# Altium project Electronic Load.PrjPcb (part 2 of 3)

## Sheet Power Page 1.SchDoc
size 406 x 304 mm; SheetNumber: 12; SheetTotal: 14
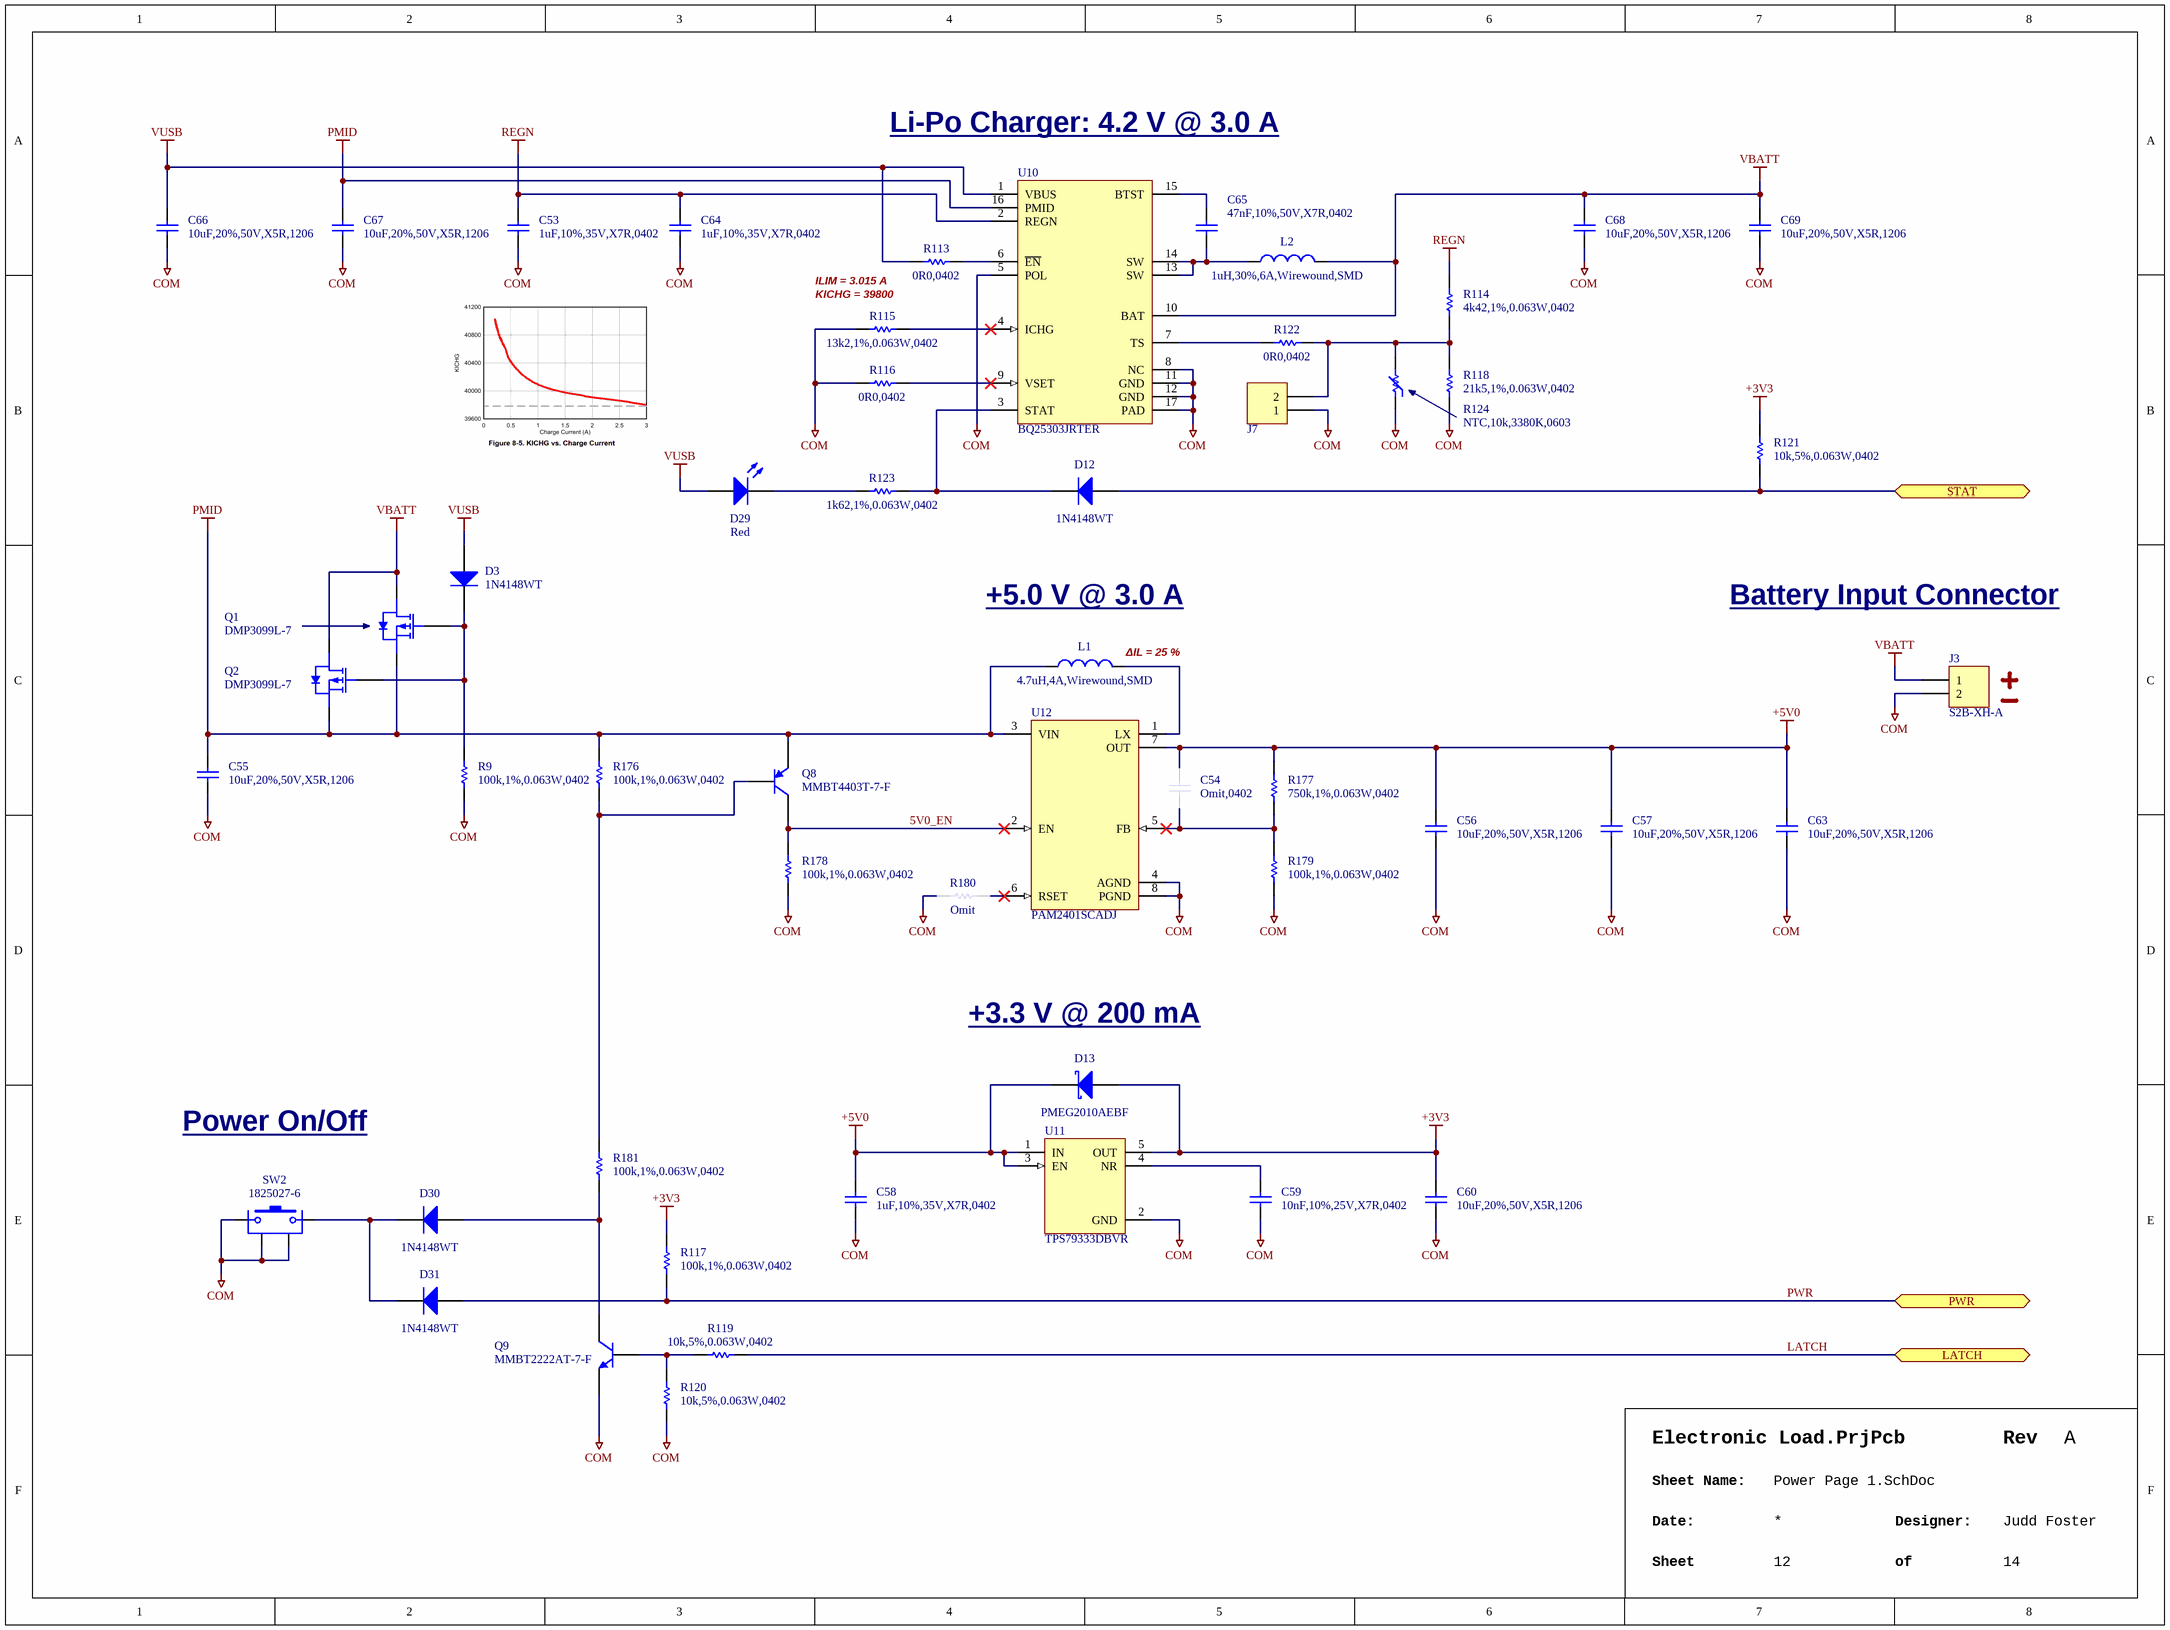
[diagram p11: Power Page 1.SchDoc]

### Parts
C53  1uF,10%,35V,X7R,0402  [CAPC1005X06N]
C54  Omit,0402  [CAPC1005X06N]  (no BOM)
C55  10uF,20%,50V,X5R,1206  [CAPC3216X16N]
C56  10uF,20%,50V,X5R,1206  [CAPC3216X16N]
C57  10uF,20%,50V,X5R,1206  [CAPC3216X16N]
C58  1uF,10%,35V,X7R,0402  [CAPC1005X06N]
C59  10nF,10%,25V,X7R,0402  [CAPC1005X06N]
C60  10uF,20%,50V,X5R,1206  [CAPC3216X16N]
C63  10uF,20%,50V,X5R,1206  [CAPC3216X16N]
C64  1uF,10%,35V,X7R,0402  [CAPC1005X06N]
C65  47nF,10%,50V,X7R,0402  [CAPC1005X06N]
C66  10uF,20%,50V,X5R,1206  [CAPC3216X16N]
C67  10uF,20%,50V,X5R,1206  [CAPC3216X16N]
C68  10uF,20%,50V,X5R,1206  [CAPC3216X16N]
C69  10uF,20%,50V,X5R,1206  [CAPC3216X16N]
D3  1N4148WT  [ONSEMI_PKG_SOD-523F]
D12  1N4148WT  [ONSEMI_PKG_SOD-523F]
D13  PMEG2010AEBF  [NEXPERIA_PKG_SOD523]
D29  Red  [LITE-ON_LTST-C190KRKT]
D30  1N4148WT  [ONSEMI_PKG_SOD-523F]
D31  1N4148WT  [ONSEMI_PKG_SOD-523F]
J3  S2B-XH-A  [JST_S2B-XH-A]
J7  Term,Header,2 Pin,Top,2.54mm  [WURTH_61300211121]  (value not drawn)
L1  4.7uH,4A,Wirewound,SMD  [TAIYO-YUDEN_NRS8030T4R7MJGJ]
L2  1uH,30%,6A,Wirewound,SMD  [TDK_VLS6045EX]
Q1  DMP3099L-7  [DIODES_SOT23]
Q2  DMP3099L-7  [DIODES_SOT23]
Q8  MMBT4403T-7-F  [DIODES_SOT523]
Q9  MMBT2222AT-7-F  [SOTFL50P160X90-3N]
R9  100k,1%,0.063W,0402  [RESC1005X04N]
R113  0R0,0402  [RESC1005X04N]
R114  4k42,1%,0.063W,0402  [RESC1005X04N]
R115  13k2,1%,0.063W,0402  [RESC1005X04N]
R116  0R0,0402  [RESC1005X04N]
R117  100k,1%,0.063W,0402  [RESC1005X04N]
R118  21k5,1%,0.063W,0402  [RESC1005X04N]
R119  10k,5%,0.063W,0402  [RESC1005X04N]
R120  10k,5%,0.063W,0402  [RESC1005X04N]
R121  10k,5%,0.063W,0402  [RESC1005X04N]
R122  0R0,0402  [RESC1005X04N]
R123  1k62,1%,0.063W,0402  [RESC1005X04N]
R124  NTC,10k,3380K,0603  [RESC_0603]
R176  100k,1%,0.063W,0402  [RESC1005X04N]
R177  750k,1%,0.063W,0402  [RESC1005X04N]
R178  100k,1%,0.063W,0402  [RESC1005X04N]
R179  100k,1%,0.063W,0402  [RESC1005X04N]
R180  Omit  [RESC1005X04N]  (no BOM)
R181  100k,1%,0.063W,0402  [RESC1005X04N]
SW2  1825027-6  [TE_1825027-6]
U10  BQ25303JRTER  [TEXASINSTRUMENTS_PKG_RTE0016C]
U11  TPS79333DBVR  [TEXASINSTRUMENTS_PKG_DBV0005A]
U12  PAM2401SCADJ  [DIODES_PKG_MSOP-8]

### Ports
LATCH (bidir), PWR (bidir), STAT (bidir)

### Nets
+3V3: C60.2 D13.2(A) R117.2 R121.1 U11.5(OUT)
+5V0: C54.2 C56.2 C57.2 C58.2 C63.2 D13.1(K) R177.2 U11.1(IN) U11.3(EN) U12.7(OUT)
COM: C53.1 C55.1 C56.1 C57.1 C58.1 C59.1 C60.1 C63.1 C64.1 C66.1 C67.1 C68.1 C69.1 J3.2 J7.1 Q9.2(E) R9.1 R115.1 R116.2 R118.1 R120.2 R124.1 R178.1 R179.1 R180.1 SW2.0 SW2.1 U10.5(POL) U10.8(NC) U10.11(GND) U10.12(GND) U10.17(PAD) U11.2(GND) U12.4(AGND) U12.8(PGND)
PMID: C55.2 C67.2 L1.1 Q1.2(S) Q2.2(S) Q8.2(E) R176.1 U10.16(PMID) U12.3(VIN)
REGN: C53.2 C64.2 R114.2 U10.2(REGN)
VBATT: C68.2 C69.2 J3.1 L2.1 Q1.3(D) Q2.3(D) U10.10(BAT)
VUSB: C66.2 D3.2(A) D29.A R113.2 U10.1(VBUS)
5V0_EN: Q8.3(C) R178.2 U12.2(EN)
LATCH: R119.1 ; port LATCH
PWR: D31.2(A) R117.1 ; port PWR
STAT: D12.2(A) R121.2 ; port STAT
NetC54_1: C54.1 R177.1 R179.2 U12.5(FB)
NetC59_2: C59.2 U11.4(NR)
NetC65_1: C65.1 L2.2 U10.13(SW) U10.14(SW)
NetC65_2: C65.2 U10.15(BTST)
NetD3_1: D3.1(K) Q1.1(G) Q2.1(G) R9.2
NetD12_1: D12.1(K) R123.1 U10.3(STAT)
NetD29_C: D29.C R123.2
NetD30_1: D30.1(K) D31.1(K) SW2.2
NetD30_2: D30.2(A) Q9.3(C) R181.2
NetJ7_2: J7.2 R114.1 R118.2 R122.1 R124.2
NetL1_2: L1.2 U12.1(LX)
NetQ8_1: Q8.1(B) R176.2 R181.1
NetQ9_1: Q9.1(B) R119.2 R120.1
NetR113_1: R113.1 U10.6(~{EN})
NetR115_2: R115.2 U10.4(ICHG)
NetR116_1: R116.1 U10.9(VSET)
NetR122_2: R122.2 U10.7(TS)
NetR180_2: R180.2 U12.6(RSET)

### Notes on the sheet
- Li-Po Charger: 4.2 V @ 3.0 A
- ILIM = 3.015 A
- (near R115) KICHG = 39800
- +5.0 V @ 3.0 A
- Battery Input Connector
- (near L1) ΔIL = 25 %
- +3.3 V @ 200 mA
- Power On/Off
- Rev
- Sheet Name:
- Date:
- Sheet
- Designer:
- of

### Library data of the parts
C53 C58 C64 = CAP,Cer,1uF,35VDC,X5R,0402: as C21 on sheet DAC; Part Name: CAP,Cer,1uF,35VDC,X5R,0402; CreatedBy: Judd Foster; HelpURL: https://product.tdk.com/info/en/catalog/datasheets/mlcc_commercial_general_en.pdf?ref_disty=digikey
C54 = CAP,Omit,0402: Omit; Part Name: CAP,Omit,0402; CreatedBy: Judd Foster; HelpURL: N/A; Manufacturer 1: N/A; Manufacturer 1 Part Number: N/A; Vendor 1: N/A; Vendor 1 Part Number: N/A; Value: Omit
C55-C57 C60 C63 C66-C69 = CAP,Cer,10uF,50VDC,X5R,1206: 10ï¿½F ï¿½20% 50V Ceramic Capacitor X5R 1206 (3216 Metric); Manufacturer 1: Samsung Electro-Mechanics; Manufacturer 1 Part Number: CL31A106MBHNNNE; Vendor 1 Part Number: 1276-6736-1-ND; Vendor 1: Digikey; Value: 10u; Part Name: CAP,Cer,10uF,50VDC,X5R,1206; CreatedBy: Judd Foster; HelpURL: https://www.samsungsem.com/resources/file/global/support/product_catalog/MLCC.pdf
C59 = CAP,Cer,10nF,10%,25V,X7R,0402: 10000pF ï¿½10% 25V Ceramic Capacitor X7R 0402 (1005 Metric); Manufacturer 1: Murata Electronics; Manufacturer 1 Part Number: GCM155R71E103KA37D; Vendor 1 Part Number: 490-6043-1-ND; Vendor 1: Digikey; Value: 10n; Part Name: CAP,Cer,10nF,10%,25V,X7R,0402; CreatedBy: Judd Foster; HelpURL: https://psearch.en.murata.com/capacitor/product/GCM155R71E103KA37%23.pdf
C65 = CAP,Cer,47nF,10%,50V,X7R,0402: 50V 47nF X7R Â±10% 0402 Multilayer Ceramic Capacitors MLCC - SMD/SMT ROHS; Manufacturer 1: YAGEO; Manufacturer 1 Part Number: CC0402KRX7R9BB473; Vendor 1 Part Number: C272875; Vendor 1: LCSC; Value: 47n; Part Name: CAP,Cer,47nF,10%,50V,X7R,0402; CreatedBy: Judd Foster; HelpURL: https://www.lcsc.com/datasheet/C272875.pdf
D3 D12 D30 D31 = DIODE,Gen,75V,150mA,SOD523F: Diode 75 V 200mA Surface Mount SOD-523F; Manufacturer 1: onsemi; Vendor 1 Part Number: 1N4148WTCT-ND; Vendor 1: DigiKey; Part Name: DIODE,Gen,75V,150mA,SOD523F; CreatedBy: Judd Foster; HelpURL: https://mm.digikey.com/Volume0/opasdata/d220001/medias/docus/6621/1N914BWTCND.pdf; Manufacturer 1 Part Number: 1N4148WT
D13 = DIODE,Schottky,20V,1A,SOD523: Diode 20 V 1A Surface Mount SOD-523; Manufacturer 1: Nexperia USA Inc.; Vendor 1 Part Number: 1727-8539-1-ND; Vendor 1: DigiKey; Part Name: DIODE,Schottky,20V,1A,SOD523; CreatedBy: Judd Foster; HelpURL: https://assets.nexperia.com/documents/data-sheet/PMEG2010AEB.pdf; Manufacturer 1 Part Number: PMEG2010AEBF
D29 = LED,Red,SMD,0603: Red 631nm LED Indication - Discrete 2V 0603 (1608 Metric); Manufacturer 1: Lite-On Inc.; Manufacturer 1 Part Number: LTST-C190KRKT; Vendor 1 Part Number: 160-1436-1-ND; Vendor 1: Digikey; Part Name: LED,Red,SMD,0603; CreatedBy: Judd Foster; HelpURL: https://optoelectronics.liteon.com/upload/download/DS-22-99-0151/LTST-C190KRKT.pdf; Value: Red
J3 = Conn,JST,2Pin,2.5mm,RA,Thru: Connector Header Through Hole, Right Angle 2 position 0.098" (2.50mm); Manufacturer 1: JST Sales America Inc.; Vendor 1 Part Number: 455-S2B-XH-A-ND; Vendor 1: DigiKey; Part Name: Conn,JST,2Pin,2.5mm,RA,Thru; CreatedBy: Judd Foster; HelpURL: https://www.jst-mfg.com/product/pdf/eng/eXH.pdf; Manufacturer 1 Part Number: S2B-XH-A
J7 = Term,Header,2 Pin,Top,2.54mm: Connector Header Through Hole 2 position 0.100" (2.54mm); Manufacturer 1: WÃ¼rth Elektronik; Manufacturer 1 Part Number: 61300211121; Vendor 1 Part Number: 732-5315-ND; Vendor 1: DigiKey; Part Name: Term,Header,2 Pin,Top,2.54mm; CreatedBy: Judd Foster; HelpURL: https://www.we-online.com/components/products/datasheet/61300211121.pdf
L1 = IND,4.7uH,4A,Wirewound,SMD: 4.7 ÂµH Shielded Drum Core, Wirewound Inductor 4 A 28.6mOhm Max Nonstandard; Manufacturer 1: Taiyo Yuden; Manufacturer 1 Part Number: NRS8030T4R7MJGJ; Vendor 1 Part Number: 587-2969-1-ND; Vendor 1: DigiKey; Value: 4.7u; Part Name: IND,4.7uH,4A,Wirewound,SMD; CreatedBy: Judd Foster; HelpURL: https://mm.digikey.com/Volume0/opasdata/d220001/medias/docus/610/NRS8030T4R7MJGJ_SS.pdf
L2 = IND,1uH,30%,6A,Wirewound,SMD: VLS6045EX-1R0N; Manufacturer 1: TDK; Vendor 1 Part Number: C404500; Vendor 1: LCSC; Part Name: IND,1uH,30%,6A,Wirewound,SMD; CreatedBy: Judd Foster; HelpURL: https://www.lcsc.com/datasheet/C404500.pdf; Manufacturer 1 Part Number: VLS6045EX-1R0N
Q1 Q2 = MOSFET,P Ch,30V,3.8A: P-Channel 30 V 3.8A (Ta) 1.08W (Ta) Surface Mount SOT-23-3; Manufacturer 1: Diodes Incorporated; Vendor 1 Part Number: DMP3099L-7DICT-ND; Vendor 1: Digikey; Part Name: MOSFET,P Ch,30V,3.8A; CreatedBy: Judd Foster; HelpURL: https://www.diodes.com/assets/Datasheets/DMP3099L.pdf; Manufacturer 1 Part Number: DMP3099L-7
Q8 = Trans,PNP,40V,600mA,SOT523: Bipolar (BJT) Transistor PNP 40 V 600 mA 200MHz 150 mW Surface Mount SOT-523; Manufacturer 1: Diodes Incorporated; Vendor 1 Part Number: MMBT4403T-FDICT-ND; Vendor 1: Digikey; Part Name: Trans,PNP,40V,600mA,SOT523; CreatedBy: Judd Foster; HelpURL: https://www.diodes.com/assets/Datasheets/ds30273.pdf; Manufacturer 1 Part Number: MMBT4403T-7-F
Q9 = Trans,NPN,40V,600mA,SOT523: Bipolar (BJT) Transistor NPN 40 V 600 mA 300MHz 150 mW Surface Mount SOT-523; Manufacturer 1: Diodes Incorporated; Vendor 1 Part Number: MMBT2222AT-FDICT-ND; Vendor 1: Digikey; Part Name: Trans,NPN,40V,600mA,SOT523; CreatedBy: Judd Foster; HelpURL: https://media.digikey.com/pdf/Data%20Sheets/Diodes%20PDFs/MMBT2222AT_Rev2016.pdf; Manufacturer 1 Part Number: MMBT2222AT-7-F
R9 R117 R176 R178 R179 R181 = RES,100k,1%,0.063W,0402: 100 kOhms Â±1% 0.063W, 1/16W Chip Resistor 0402 (1005 Metric) Moisture Resistant Thick Film; Manufacturer 1: YAGEO; Manufacturer 1 Part Number: RC0402FR-07100KL; Vendor 1 Part Number: 311-100KLRCT-ND; Vendor 1: DigiKey; Part Name: RES,100k,1%,0.063W,0402; CreatedBy: Judd Foster; HelpURL: https://www.yageo.com/upload/media/product/products/datasheet/rchip/PYu-RC_Group_51_RoHS_L_12.pdf; Value: 100k
R113 R116 R122 = RES,0R0,0402: as R1 on sheet IGBT Current Control; Part Name: RES,0R0,0402; CreatedBy: Judd Foster; HelpURL: https://industrial.panasonic.com/cdbs/www-data/pdf/RDA0000/AOA0000C301.pdf
R114 = RES,4k42,1%,0.063W,0402: 62.5mW 4.42kÎ© 50V Â±100ppm/â„ƒ Thick Film Resistor Â±1% 0402 Chip Resistor - Surface Mount ROHS; Manufacturer 1: FOJAN; Manufacturer 1 Part Number: FRC0402F4421TS; Vendor 1 Part Number: C3013170; Vendor 1: LCSC; Part Name: RES,4k42,1%,0.063W,0402; CreatedBy: Judd Foster; HelpURL: https://www.lcsc.com/datasheet/C3013170.pdf; Value: 4k42
R115 = RES,13k2,1%,0.063W,0402: 13.2 kOhms Â±1% 0.063W, 1/16W Chip Resistor 0402 (1005 Metric) Automotive AEC-Q200, Moisture Resistant Metal Film; Manufacturer 1: KOA Speer Electronics, Inc.; Manufacturer 1 Part Number: RN73H1ETTP1322F25; Vendor 1 Part Number: 2019-RN73H1ETTP1322F25CT-ND; Vendor 1: DigiKey; Part Name: RES,13k2,1%,0.063W,0402; CreatedBy: Judd Foster; HelpURL: https://www.koaspeer.com/pdfs/RN73H.pdf
R118 = RES,21k5,1%,0.063W,0402: 21.5kÎ© 62.5mW 50V Â±100ppm/â„ƒ Thick Film Resistor Â±1% 0402 Chip Resistor - Surface Mount ROHS; Manufacturer 1: FOJAN; Manufacturer 1 Part Number: FRC0402F2152TS; Vendor 1 Part Number: C2933081; Vendor 1: LCSC; Part Name: RES,21k5,1%,0.063W,0402; CreatedBy: Judd Foster; HelpURL: https://www.lcsc.com/datasheet/C2933081.pdf; Value: 21k5
R119-R121 = RES,10k,5%,0.063W,0402: as R30 on sheet IGBT Current Control; Part Name: RES,10k,5%,0.063W,0402; CreatedBy: Judd Foster; HelpURL: https://www.seielect.com/catalog/sei-rmcf_rmcp.pdf; Value: 10k
R123 = RES,1k62,1%,0.063W,0402: 1.62 kOhms Â±1% 0.063W, 1/16W Chip Resistor 0402 (1005 Metric) Moisture Resistant Thick Film; Manufacturer 1: YAGEO; Manufacturer 1 Part Number: RC0402FR-071K62L; Vendor 1 Part Number: YAG3042CT-ND; Vendor 1: DigiKey; Part Name: RES,1k62,1%,0.063W,0402; CreatedBy: Judd Foster; HelpURL: https://www.yageo.com/upload/media/product/products/datasheet/rchip/PYu-RC_Group_51_RoHS_L_12.pdf; Value: 1k62
R124 = RES,Thermistor,NTC,10k,3380K,0603: 10kÎ© 100mW Â±1% 310uA 3380K Â±1% 0603 NTC Thermistors ROHS; Manufacturer 1: Murata; Manufacturer 1 Part Number: NCP18XH103F03RB; Vendor 1 Part Number: C13564; Vendor 1: LCSC; Part Name: RES,Thermistor,NTC,10k,3380K,0603; CreatedBy: Judd Foster; HelpURL: https://www.lcsc.com/datasheet/C13564.pdf
R177 = RES,750k,1%,0.063W,0402: 750 kOhms ï¿½1% 0.063W, 1/16W Chip Resistor 0402 (1005 Metric) Moisture Resistant Thick Film; Manufacturer 1: YAGEO; Manufacturer 1 Part Number: RC0402FR-07750KL; Vendor 1 Part Number: YAG3228CT-ND; Vendor 1: Digikey; Part Name: RES,750k,1%,0.063W,0402; CreatedBy: Judd Foster; HelpURL: https://www.yageo.com/upload/media/product/app/datasheet/rchip/pyu-rc_group_51_rohs_l.pdf; Value: 750k,1%,0.063W,0402
R180 = RES,Omit,0402: Part Name: RES,Omit,0402; CreatedBy: Judd Foster; HelpURL: N/A; Manufacturer 1: N/A; Manufacturer 1 Part Number: N/A; Vendor 1: N/A; Vendor 1 Part Number: N/A; Value: Omit
SW2 = Switch,Tactile,SPST-NO,RA,Thru: 24V With Bracket Round Button SPST 50mA Through Hole Tactile Switches RoHS; Manufacturer 1: TE Connectivity; Vendor 1 Part Number: C2928196; Vendor 1: LCSC; Part Name: Switch,Tactile,SPST-NO,RA,Thru; CreatedBy: Judd Foster; HelpURL: https://www.lcsc.com/datasheet/C2928196.pdf; Manufacturer 1 Part Number: 1825027-6
U10 = BQ25303JRTER: Charger IC Lithium Ion/Polymer 16-WQFN (3x3); Manufacturer 1: Texas Instruments; Vendor 1 Part Number: 296-BQ25303JRTERCT-ND; Vendor 1: DigiKey; Part Name: BQ25303JRTER; CreatedBy: Judd Foster; HelpURL: https://www.ti.com/lit/ds/symlink/bq25303j.pdf?HQS=dis-dk-null-digikeymode-dsf-pf-null-wwe&ts=1761554135734; Manufacturer 1 Part Number: BQ25303JRTER
U11 = TPS79333DBVR: 70dB@(10kHz) Positive Fixed 3.3V SOT-23-5 Voltage Regulators - Linear, Low Drop Out (LDO) Regulators ROHS; Manufacturer 1: Texas Instruments; Vendor 1 Part Number: C9840; Vendor 1: LCSC; Part Name: TPS79333DBVR; CreatedBy: Judd Foster; HelpURL: https://www.lcsc.com/datasheet/C9840.pdf; Manufacturer 1 Part Number: TPS79333DBVR
U12 = PAM2401SCADJ: Boost Switching Regulator IC Positive Adjustable 2.5V 1 Output 1A 8-TSSOP, 8-MSOP (0.118", 3.00mm Width); Manufacturer 1: Diodes Incorporated; Vendor 1 Part Number: PAM2401SCADJDICT-ND; Vendor 1: DigiKey; Part Name: PAM2401SCADJ; CreatedBy: Judd Foster; HelpURL: https://www.diodes.com/assets/Datasheets/PAM2401.pdf; Manufacturer 1 Part Number: PAM2401SCADJ

## Sheet User Interface.SchDoc
size 406 x 304 mm; SheetNumber: 14; SheetTotal: 14
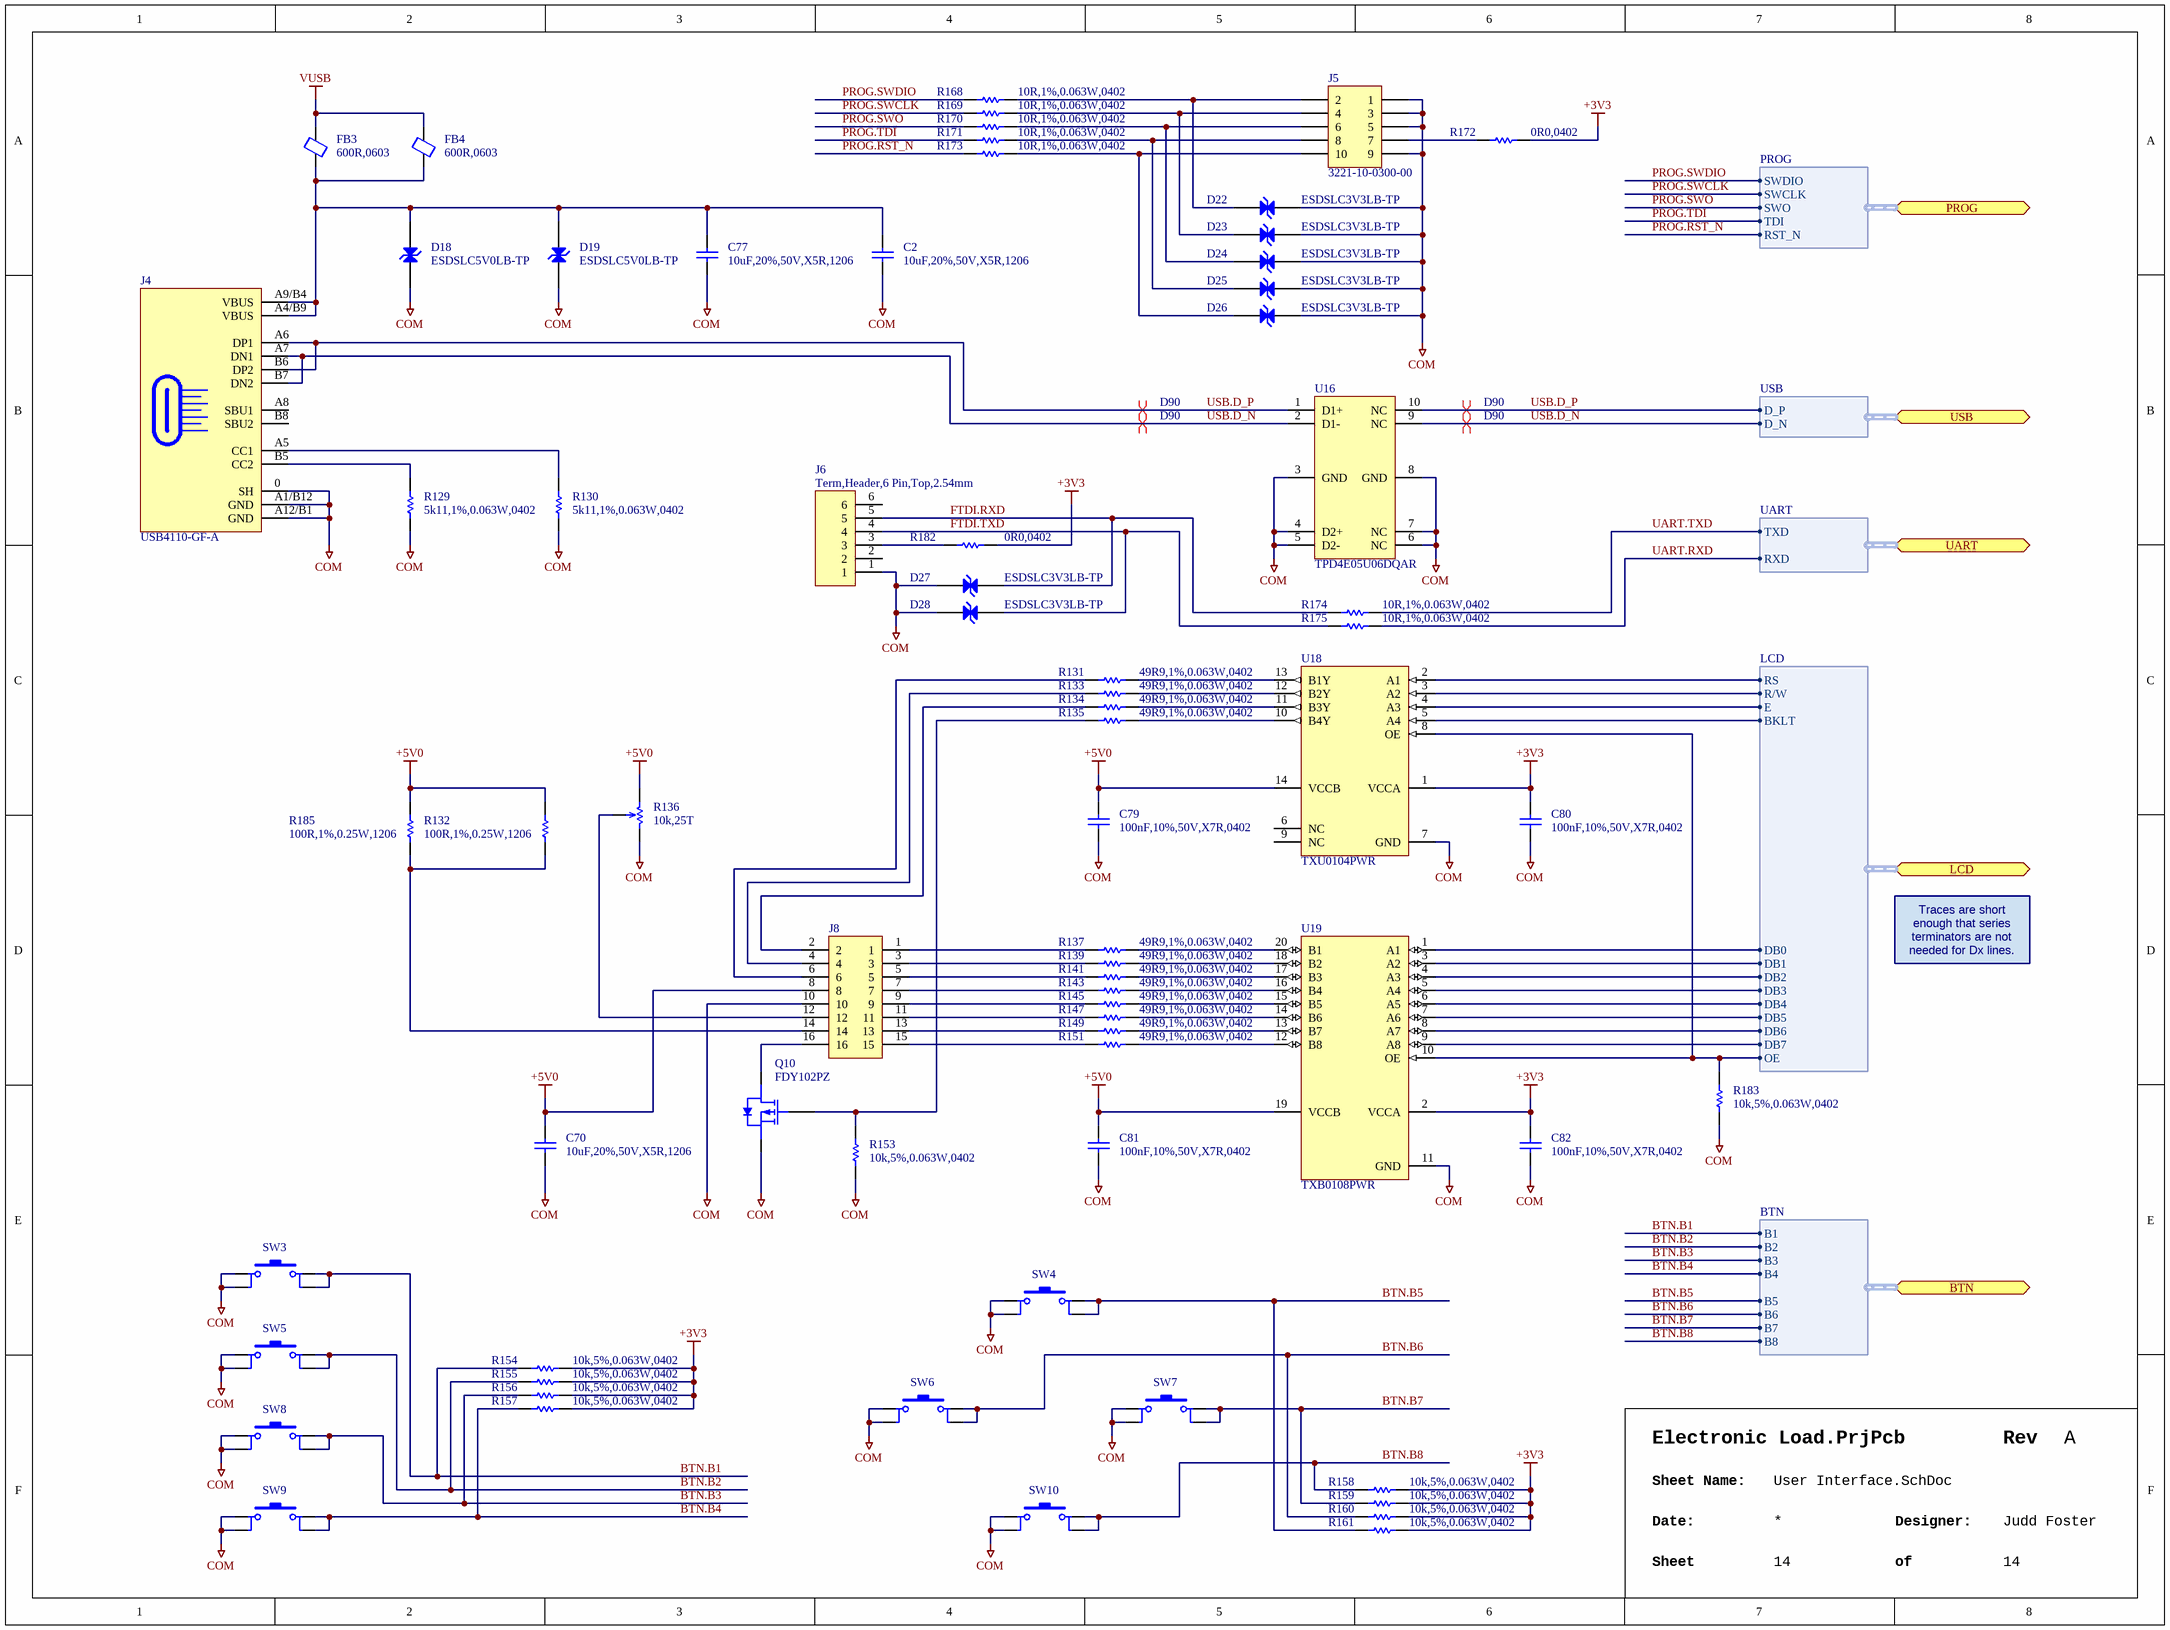
[diagram p12: User Interface.SchDoc]

### Parts
C2  10uF,20%,50V,X5R,1206  [CAPC3216X16N]
C70  10uF,20%,50V,X5R,1206  [CAPC3216X16N]
C77  10uF,20%,50V,X5R,1206  [CAPC3216X16N]
C79  100nF,10%,50V,X7R,0402  [CAPC1005X06N]
C80  100nF,10%,50V,X7R,0402  [CAPC1005X06N]
C81  100nF,10%,50V,X7R,0402  [CAPC1005X06N]
C82  100nF,10%,50V,X7R,0402  [CAPC1005X06N]
D18  ESDSLC5V0LB-TP  [MICROCOMMERCIAL_DFN1006-2_NPOL]
D19  ESDSLC5V0LB-TP  [MICROCOMMERCIAL_DFN1006-2_NPOL]
D22  ESDSLC3V3LB-TP  [DFN65P100X50-2N]
D23  ESDSLC3V3LB-TP  [DFN65P100X50-2N]
D24  ESDSLC3V3LB-TP  [DFN65P100X50-2N]
D25  ESDSLC3V3LB-TP  [DFN65P100X50-2N]
D26  ESDSLC3V3LB-TP  [DFN65P100X50-2N]
D27  ESDSLC3V3LB-TP  [DFN65P100X50-2N]
D28  ESDSLC3V3LB-TP  [DFN65P100X50-2N]
FB3  600R,0603  [INDC_0603]
FB4  600R,0603  [INDC_0603]
J4  USB4110-GF-A  [GCT_USB4110-GF-A]
J5  3221-10-0300-00  [CNC Tech_3221-10-0300-00]
J6  Term,Header,6 Pin,Top,2.54mm  [WURTH_61300611121]
J8  PPPC082LFBN-RC  [SULLINS_PPPC082LFBN-RC]  (value not drawn)
Q10  FDY102PZ  [ONSEMI_SC-89]
R129  5k11,1%,0.063W,0402  [RESC1005X04N]
R130  5k11,1%,0.063W,0402  [RESC1005X04N]
R131  49R9,1%,0.063W,0402  [RESC1005X04N]
R132  100R,1%,0.25W,1206  [SEI_PKG_RMCF1206]
R133  49R9,1%,0.063W,0402  [RESC1005X04N]
R134  49R9,1%,0.063W,0402  [RESC1005X04N]
R135  49R9,1%,0.063W,0402  [RESC1005X04N]
R136  10k,25T  [BOURNS_3296W]
R137  49R9,1%,0.063W,0402  [RESC1005X04N]
R139  49R9,1%,0.063W,0402  [RESC1005X04N]
R141  49R9,1%,0.063W,0402  [RESC1005X04N]
R143  49R9,1%,0.063W,0402  [RESC1005X04N]
R145  49R9,1%,0.063W,0402  [RESC1005X04N]
R147  49R9,1%,0.063W,0402  [RESC1005X04N]
R149  49R9,1%,0.063W,0402  [RESC1005X04N]
R151  49R9,1%,0.063W,0402  [RESC1005X04N]
R153  10k,5%,0.063W,0402  [RESC1005X04N]
R154  10k,5%,0.063W,0402  [RESC1005X04N]
R155  10k,5%,0.063W,0402  [RESC1005X04N]
R156  10k,5%,0.063W,0402  [RESC1005X04N]
R157  10k,5%,0.063W,0402  [RESC1005X04N]
R158  10k,5%,0.063W,0402  [RESC1005X04N]
R159  10k,5%,0.063W,0402  [RESC1005X04N]
R160  10k,5%,0.063W,0402  [RESC1005X04N]
R161  10k,5%,0.063W,0402  [RESC1005X04N]
R168  10R,1%,0.063W,0402  [RESC1005X04N]
R169  10R,1%,0.063W,0402  [RESC1005X04N]
R170  10R,1%,0.063W,0402  [RESC1005X04N]
R171  10R,1%,0.063W,0402  [RESC1005X04N]
R172  0R0,0402  [RESC1005X04N]
R173  10R,1%,0.063W,0402  [RESC1005X04N]
R174  10R,1%,0.063W,0402  [RESC1005X04N]
R175  10R,1%,0.063W,0402  [RESC1005X04N]
R182  0R0,0402  [RESC1005X04N]
R183  10k,5%,0.063W,0402  [RESC1005X04N]
R185  100R,1%,0.25W,1206  [SEI_PKG_RMCF1206]
SW3  PTS645SK43SMTR92 LFS  [C&K_PTS645SK43SMTR92 LFS]  (value not drawn)
SW4  PTS645SK43SMTR92 LFS  [C&K_PTS645SK43SMTR92 LFS]  (value not drawn)
SW5  PTS645SK43SMTR92 LFS  [C&K_PTS645SK43SMTR92 LFS]  (value not drawn)
SW6  PTS645SK43SMTR92 LFS  [C&K_PTS645SK43SMTR92 LFS]  (value not drawn)
SW7  PTS645SK43SMTR92 LFS  [C&K_PTS645SK43SMTR92 LFS]  (value not drawn)
SW8  PTS645SK43SMTR92 LFS  [C&K_PTS645SK43SMTR92 LFS]  (value not drawn)
SW9  PTS645SK43SMTR92 LFS  [C&K_PTS645SK43SMTR92 LFS]  (value not drawn)
SW10  PTS645SK43SMTR92 LFS  [C&K_PTS645SK43SMTR92 LFS]  (value not drawn)
U16  TPD4E05U06DQAR  [TEXASINSTRUMENTS_PKG_DQA0009A]
U18  TXU0104PWR  [SOP65P640X120-14N]
U19  TXB0108PWR  [TEXASINSTRUMENTS_PKG_PW0020A]

### Ports
BTN (bidir, harness BTN), LCD (bidir, harness LCD), PROG (bidir, harness PROG), UART (bidir, harness UART), USB (bidir, harness USB)

### Harnesses
USB: D_P, D_N
LCD: RS, R/W, E, BKLT, DB0, DB1, DB2, DB3, DB4, DB5, DB6, DB7, OE
BTN: B1, B2, B3, B4, B5, B6, B7, B8
UART: TXD, RXD
PROG: SWDIO, SWCLK, SWO, TDI, RST_N

### Nets
+3V3: C80.2 C82.2 R154.2 R155.2 R156.2 R157.2 R158.2 R159.2 R160.2 R161.2 R172.2 R182.2 U18.1(VCCA) U19.2(VCCA)
+5V0: C70.2 C79.2 C81.2 J8.8 R132.2 R136.3 R185.2 U18.14(VCCB) U19.19(VCCB)
COM: C2.1 C70.1 C77.1 C79.1 C80.1 C81.1 C82.1 D18.2(A) D19.2(A) D22.1(K) D23.1(K) D24.1(K) D25.1(K) D26.1(K) D27.2(A) D28.2(A) J4.0(SH) J4.A1/B12(GND) J4.A12/B1(GND) J5.1 J5.3 J5.5 J5.9 J6.1 J8.10 Q10.2(S) R129.1 R130.1 R136.1 R153.1 R183.1 SW3.1 SW3.2 SW4.1 SW4.2 SW5.1 SW5.2 SW6.1 SW6.2 SW7.1 SW7.2 SW8.1 SW8.2 SW9.1 SW9.2 SW10.1 SW10.2 U16.3(GND) U16.4(D2+) U16.5(D2-) U16.6(NC) U16.7(NC) U16.8(GND) U18.7(GND) U19.11(GND)
VUSB: FB3.2 FB4.2
BTN.B1: R154.1 SW3.3 SW3.4 ; port BTN.B1
BTN.B2: R155.1 SW5.3 SW5.4 ; port BTN.B2
BTN.B3: R156.1 SW8.3 SW8.4 ; port BTN.B3
BTN.B4: R157.1 SW9.3 SW9.4 ; port BTN.B4
BTN.B5: R161.1 SW4.3 SW4.4 ; port BTN.B5
BTN.B6: R160.1 SW6.3 SW6.4 ; port BTN.B6
BTN.B7: R159.1 SW7.3 SW7.4 ; port BTN.B7
BTN.B8: R158.1 SW10.3 SW10.4 ; port BTN.B8
FTDI.RXD: D27.1(K) J6.5 R174.1
FTDI.TXD: D28.1(K) J6.4 R175.1
LCD.BKLT: U18.5(A4) ; port LCD.BKLT
LCD.DB0: U19.1(A1) ; port LCD.DB0
LCD.DB1: U19.3(A2) ; port LCD.DB1
LCD.DB2: U19.4(A3) ; port LCD.DB2
LCD.DB3: U19.5(A4) ; port LCD.DB3
LCD.DB4: U19.6(A5) ; port LCD.DB4
LCD.DB5: U19.7(A6) ; port LCD.DB5
LCD.DB6: U19.8(A7) ; port LCD.DB6
LCD.DB7: U19.9(A8) ; port LCD.DB7
LCD.E: U18.4(A3) ; port LCD.E
LCD.OE: R183.2 U18.8(OE) U19.10(OE) ; port LCD.OE
LCD.R/W: U18.3(A2) ; port LCD.R/W
LCD.RS: U18.2(A1) ; port LCD.RS
PROG.RST_N: R173.1 ; port PROG.RST_N
PROG.SWCLK: R169.1 ; port PROG.SWCLK
PROG.SWDIO: R168.1 ; port PROG.SWDIO
PROG.SWO: R170.1 ; port PROG.SWO
PROG.TDI: R171.1 ; port PROG.TDI
UART.RXD: R175.2 ; port UART.RXD
UART.TXD: R174.2 ; port UART.TXD
USB.D_N: J4.A7(DN1) J4.B7(DN2) U16.2(D1-) U16.9(NC) ; port USB.D_N
USB.D_P: J4.A6(DP1) J4.B6(DP2) U16.1(D1+) U16.10(NC) ; port USB.D_P
NetC2_2: C2.2 C77.2 D18.1(K) D19.1(K) FB3.1 FB4.1 J4.A4/B9(VBUS) J4.A9/B4(VBUS)
NetD22_2: D22.2(A) J5.2 R168.2
NetD23_2: D23.2(A) J5.4 R169.2
NetD24_2: D24.2(A) J5.6 R170.2
NetD25_2: D25.2(A) J5.8 R171.2
NetD26_2: D26.2(A) J5.10 R173.2
NetJ4_A5: J4.A5(CC1) R130.2
NetJ4_B5: J4.B5(CC2) R129.2
NetJ5_7: J5.7 R172.1
NetJ6_3: J6.3 R182.1
NetJ8_1: J8.1 R137.1
NetJ8_2: J8.2 R134.1
NetJ8_3: J8.3 R139.1
NetJ8_4: J8.4 R133.1
NetJ8_5: J8.5 R141.1
NetJ8_6: J8.6 R131.1
NetJ8_7: J8.7 R143.1
NetJ8_9: J8.9 R145.1
NetJ8_11: J8.11 R147.1
NetJ8_12: J8.12 R136.2
NetJ8_13: J8.13 R149.1
NetJ8_14: J8.14 R132.1 R185.1
NetJ8_15: J8.15 R151.1
NetJ8_16: J8.16 Q10.3(D)
NetQ10_1: Q10.1(G) R135.1 R153.2
NetR131_2: R131.2 U18.13(B1Y)
NetR133_2: R133.2 U18.12(B2Y)
NetR134_2: R134.2 U18.11(B3Y)
NetR135_2: R135.2 U18.10(B4Y)
NetR137_2: R137.2 U19.20(B1)
NetR139_2: R139.2 U19.18(B2)
NetR141_2: R141.2 U19.17(B3)
NetR143_2: R143.2 U19.16(B4)
NetR145_2: R145.2 U19.15(B5)
NetR147_2: R147.2 U19.14(B6)
NetR149_2: R149.2 U19.13(B7)
NetR151_2: R151.2 U19.12(B8)

Not connected (* = marked no-connect by the designer): J4 A8(SBU1) B8(SBU2); J6 2 6; U18 6(NC) 9(NC)

### Layout directives
differential pair; differential pair class D90: USB.D_N, USB.D_P

### Notes on the sheet
- Traces are short enough that series terminators are not needed for Dx lines.
- Rev
- Sheet Name:
- Date:
- Sheet
- Designer:
- of

### Library data of the parts
C2 C70 C77 = CAP,Cer,10uF,50VDC,X5R,1206: 10ï¿½F ï¿½20% 50V Ceramic Capacitor X5R 1206 (3216 Metric); Manufacturer 1: Samsung Electro-Mechanics; Manufacturer 1 Part Number: CL31A106MBHNNNE; Vendor 1 Part Number: 1276-6736-1-ND; Vendor 1: Digikey; Value: 10u; Part Name: CAP,Cer,10uF,50VDC,X5R,1206; CreatedBy: Judd Foster; HelpURL: https://www.samsungsem.com/resources/file/global/support/product_catalog/MLCC.pdf
C79-C82 = CAP,Cer,100nF,10%,50V,X7R,0402: 50V 100nF X7R Â±10% 0402 Ceramic Capacitors ROHS; Manufacturer 1: Murata; Manufacturer 1 Part Number: GRM155R71H104KE14D; Vendor 1 Part Number: C77020; Vendor 1: LCSC; Value: 100n; Part Name: CAP,Cer,100nF,10%,50V,X7R,0402; CreatedBy: Judd Foster; HelpURL: https://www.lcsc.com/datasheet/C77020.pdf
D18 D19 = DIODE,TVS,5.0V,SOD882: 20V Clamp 4A (8/20ï¿½s) Ipp Tvs Diode Surface Mount 2-DFN1006; Manufacturer 1: Micro Commercial Co; Vendor 1 Part Number: ESDSLC5V0LB-TPMSCT-ND; Vendor 1: Digikey; Part Name: DIODE,TVS,5.0V,SOD882; CreatedBy: Judd Foster; HelpURL: https://www.mccsemi.com/pdf/Products/ESDSLC5V0LB(DFN1006-2).pdf; Manufacturer 1 Part Number: ESDSLC5V0LB-TP
D22-D28 = DIODE,TVS,3.3V,SOD882: 20V Clamp 5A (8/20ï¿½s) Ipp Tvs Diode Surface Mount DFN1006-2; Manufacturer 1: Micro Commercial Co; Vendor 1 Part Number: ESDSLC3V3LB-TPMSCT-ND; Vendor 1: Digikey; Part Name: DIODE,TVS,3.3V,SOD882; CreatedBy: Judd Foster; HelpURL: https://www.mccsemi.com/pdf/Products/ESDSLC3V3LB(DFN1006-2).pdf; Manufacturer 1 Part Number: ESDSLC3V3LB-TP
FB3 FB4 = FERRITE,600R@100MHz,350mA,0603: 500mÎ© Â±25% 600Î©@100MHz 0603 Ferrite Beads and Chips ROHS; Manufacturer 1: TAI-TECH; Manufacturer 1 Part Number: FCM1608KF-601T03; Vendor 1 Part Number: C141723; Vendor 1: LCSC; Part Name: FERRITE,600R@100MHz,350mA,0603; CreatedBy: Judd Foster; HelpURL: https://www.lcsc.com/datasheet/C141723.pdf
J4 = Conn,USB-C,SMD: USB-C (USB TYPE-C) USB 2.0 Receptacle Connector 24 (16+8 Dummy) Position Surface Mount, Right Angle; Manufacturer 1: GCT; Vendor 1 Part Number: 2073-USB4110-GF-A-1-ND; Vendor 1: Digikey; Part Name: Conn,USB-C,SMD; CreatedBy: Judd Foster; HelpURL: https://gct.co/files/drawings/usb4110.pdf; Manufacturer 1 Part Number: USB4110-GF-A
J5 = Term,Header,5x2 Pin,Shroud,1.27mm,SMD: Connector Header Surface Mount 10 position 0.050" (1.27mm); Manufacturer 1: CNC Tech; Vendor 1 Part Number: 1175-1735-ND; Vendor 1: Digikey; Part Name: Term,Header,5x2 Pin,Shroud,1.27mm,SMD; CreatedBy: Judd Foster; HelpURL: http://www.cnctech.us/pdfs/3221-XX-0300-00_.pdf; Manufacturer 1 Part Number: 3221-10-0300-00
J6 = Term,Header,6 Pin,Top,2.54mm: Connector Header Through Hole 6 position 0.100" (2.54mm); Manufacturer 1: WÃ¼rth Elektronik; Manufacturer 1 Part Number: 61300611121; Vendor 1 Part Number: 732-5319-ND; Vendor 1: DigiKey; Part Name: Term,Header,6 Pin,Top,2.54mm; CreatedBy: Judd Foster; HelpURL: https://www.we-online.com/components/products/datasheet/61300611121.pdf
J8 = Term,Rcpt,2x8 Pin,2.54mm,Top,Thru: 16 Position Header Connector 0.100" (2.54mm) Through Hole Gold; Manufacturer 1: Sullins Connector Solutions; Vendor 1 Part Number: S7111-ND; Vendor 1: DigiKey; Part Name: Term,Rcpt,2x8 Pin,2.54mm,Top,Thru; CreatedBy: Judd Foster; HelpURL: https://mm.digikey.com/Volume0/opasdata/d220001/medias/docus/937/Female_Headers.100_DS.pdf; Manufacturer 1 Part Number: PPPC082LFBN-RC
Q10 = MOSFET,P Ch,20V,830mA: P-Channel 20 V 830mA (Ta) 625mW (Ta) Surface Mount SC-89-3; Manufacturer 1: onsemi; Vendor 1 Part Number: FDY102PZCT-ND; Vendor 1: Digikey; Part Name: MOSFET,P Ch,20V,830mA; CreatedBy: Judd Foster; HelpURL: https://rocelec.widen.net/view/pdf/hh954mlmw6/FAIR-S-A0000083184-1.pdf?t.download=true&u=5oefqw; Manufacturer 1 Part Number: FDY102PZ
R129 R130 = RES,5k11,1%,0.063W,0402: 5.11 kOhms ï¿½1% 0.063W, 1/16W Chip Resistor 0402 (1005 Metric) Automotive AEC-Q200, Moisture Resistant Thick Film; Manufacturer 1: Yageo; Manufacturer 1 Part Number: AC0402FR-075K11L; Vendor 1 Part Number: 13-AC0402FR-075K11LCT-ND; Vendor 1: Digikey; Part Name: RES,5k11,1%,0.063W,0402; CreatedBy: Judd Foster; HelpURL: https://www.yageo.com/upload/media/product/productsearch/datasheet/rchip/PYu-AC_51_RoHS_L_7.pdf; Value: 5k11
R131 R133-R135 R137 R139 R141 R143 R145 R147 R149 R151 = RES,49R9,1%,0.063W,0402: 49.9 Ohms Â±1% 0.063W, 1/16W Chip Resistor 0402 (1005 Metric) Moisture Resistant Thick Film; Manufacturer 1: YAGEO; Manufacturer 1 Part Number: RC0402FR-0749R9L; Vendor 1 Part Number: 311-49.9LRCT-ND; Vendor 1: DigiKey; Value: 49.9; Part Name: RES,49R9,1%,0.063W,0402; CreatedBy: Judd Foster; HelpURL: https://www.yageo.com/upload/media/product/products/datasheet/rchip/PYu-RC_Group_51_RoHS_L_12.pdf
R132 R185 = RES,100R,1%,0.25W,1206: 100 Ohms Â±1% 0.25W, 1/4W Chip Resistor 1206 (3216 Metric) Automotive AEC-Q200 Thick Film; Manufacturer 1: Stackpole Electronics Inc; Manufacturer 1 Part Number: RMCF1206FT100R; Vendor 1 Part Number: RMCF1206FT100RCT-ND; Vendor 1: DigiKey; Part Name: RES,100R,1%,0.25W,1206; CreatedBy: Judd Foster; HelpURL: https://www.seielect.com/catalog/sei-rmcf_rmcp.pdf; Value: 100R
R136 = RES,Trimmer,25T,10k,Thru: Â±10% Â±100ppm/â„ƒ 500mW 10kÎ© SIP-3P,9.5x4.8mm Trimmer Potentiometers ROHS; Manufacturer 1: Bourns; Manufacturer 1 Part Number: 3296W-1-103LF; Vendor 1 Part Number: C34846; Vendor 1: LCSC; Part Name: RES,Trimmer,25T,10k,Thru; CreatedBy: Judd Foster; HelpURL: https://www.lcsc.com/datasheet/C34846.pdf
R153-R161 R183 = RES,10k,5%,0.063W,0402: 10 kOhms ï¿½5% 0.063W, 1/16W Chip Resistor 0402 (1005 Metric) Automotive AEC-Q200 Thick Film; Manufacturer 1: Stackpole Electronics Inc; Manufacturer 1 Part Number: RMCF0402JT10K0; Vendor 1 Part Number: RMCF0402JT10K0CT-ND; Vendor 1: DIgikey; Part Name: RES,10k,5%,0.063W,0402; CreatedBy: Judd Foster; HelpURL: https://www.seielect.com/catalog/sei-rmcf_rmcp.pdf; Value: 10k
R168-R171 R173-R175 = RES,10R,1%,0.063W,0402: 10 Ohms ï¿½1% 0.063W, 1/16W Chip Resistor 0402 (1005 Metric) Automotive AEC-Q200 Thick Film; Manufacturer 1: Panasonic Electronic Components; Manufacturer 1 Part Number: ERJ-2RKF10R0X; Vendor 1 Part Number: P10.0LCT-ND; Vendor 1: Digikey; Value: 10; Part Name: RES,10R,1%,0.063W,0402; CreatedBy: Judd Foster; HelpURL: https://industrial.panasonic.com/cdbs/www-data/pdf/RDA0000/AOA0000C304.pdf
R172 R182 = RES,0R0,0402: 0 Ohms Jumper 0.1W, 1/10W Chip Resistor 0402 (1005 Metric) Automotive AEC-Q200 Thick Film; Manufacturer 1: Panasonic Electronic Components; Manufacturer 1 Part Number: ERJ-2GE0R00X; Vendor 1 Part Number: P0.0JCT-ND; Vendor 1: Digikey; Value: 0; Part Name: RES,0R0,0402; CreatedBy: Judd Foster; HelpURL: https://industrial.panasonic.com/cdbs/www-data/pdf/RDA0000/AOA0000C301.pdf
SW3-SW10 = Switch,Tactile,SPST-NO,SMD,H4.3: Tactile Switch SPST-NO Top Actuated Surface Mount; Manufacturer 1: C&K; Vendor 1 Part Number: CKN9084CT-ND; Vendor 1: Digikey; Part Name: Switch,Tactile,SPST-NO,SMD,H4.3; CreatedBy: Judd Foster; HelpURL: https://www.ckswitches.com/media/1471/pts645.pdf; Manufacturer 1 Part Number: PTS645SK43SMTR92 LFS
U16 = TPD4E05U06DQAR: 2.5A@8/20us 14V 40W@8/20us 6.5V Unidirectional 5.5V USON-10(1x2.5) TVS Diodes ROHS; Manufacturer 1: Texas Instruments; Vendor 1 Part Number: C138714; Vendor 1: LCSC; Part Name: TPD4E05U06DQAR; CreatedBy: Judd Foster; HelpURL: https://www.lcsc.com/datasheet/C138714.pdf; Manufacturer 1 Part Number: TPD4E05U06DQAR
U18 = TXU0104PWR: General Purpose Amplifier Circuit Rail-to-Rail 8-VSSOP; Manufacturer 1: Texas Instruments; Vendor 1 Part Number: 296-TXU0104PWRCT-ND; Vendor 1: Digikey; Part Name: TXU0104PWR; CreatedBy: Judd Foster; HelpURL: http://www.ti.com/general/docs/suppproductinfo.tsp?distId=10&gotoUrl=http%3A%2F%2Fwww.ti.com%2Flit%2Fgpn%2FTXU0104; Manufacturer 1 Part Number: TXU0104PWR
U19 = TXB0108PWR: 100Mbps 1 8 TSSOP-20 Translators, Level Shifters ROHS; Manufacturer 1: Texas Instruments; Vendor 1 Part Number: C53406; Vendor 1: LCSC; Part Name: TXB0108PWR; CreatedBy: Judd Foster; HelpURL: https://www.lcsc.com/datasheet/C53406.pdf; Manufacturer 1 Part Number: TXB0108PWR

## Sheet Power Page 2.SchDoc
size 406 x 304 mm; SheetNumber: 13; SheetTotal: 14
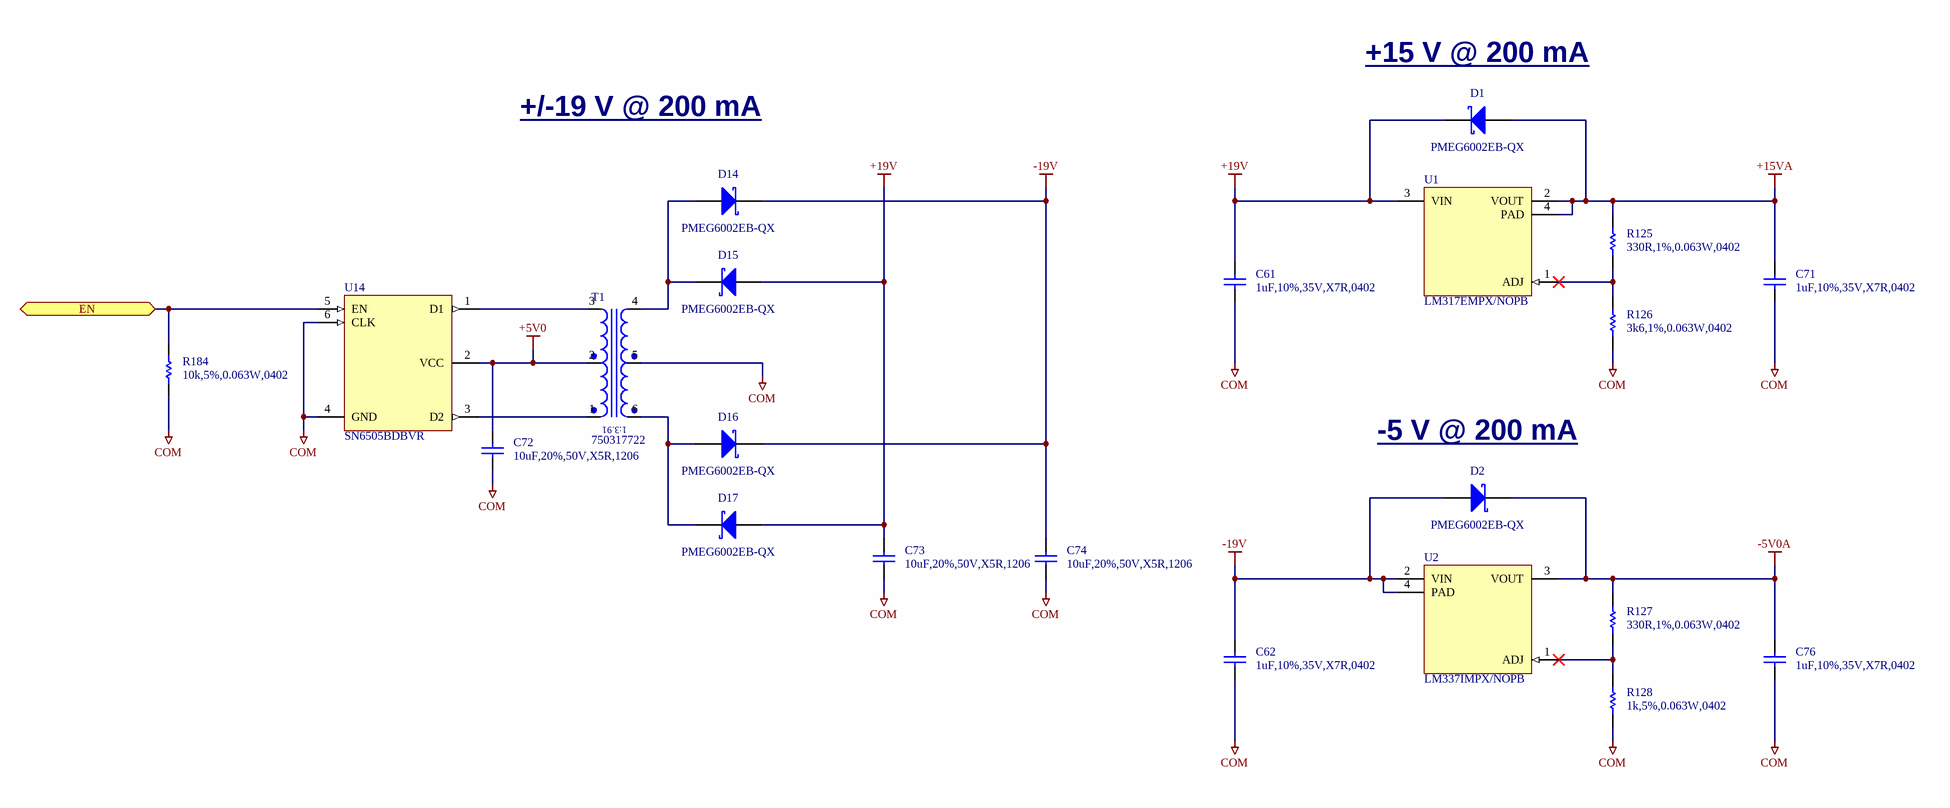
[diagram p13: Power Page 2.SchDoc]

### Parts
C61  1uF,10%,35V,X7R,0402  [CAPC1005X06N]
C62  1uF,10%,35V,X7R,0402  [CAPC1005X06N]
C71  1uF,10%,35V,X7R,0402  [CAPC1005X06N]
C72  10uF,20%,50V,X5R,1206  [CAPC3216X16N]
C73  10uF,20%,50V,X5R,1206  [CAPC3216X16N]
C74  10uF,20%,50V,X5R,1206  [CAPC3216X16N]
C76  1uF,10%,35V,X7R,0402  [CAPC1005X06N]
D1  PMEG6002EB-QX  [NEXPERIA_PKG_SOD523]
D2  PMEG6002EB-QX  [NEXPERIA_PKG_SOD523]
D14  PMEG6002EB-QX  [NEXPERIA_PKG_SOD523]
D15  PMEG6002EB-QX  [NEXPERIA_PKG_SOD523]
D16  PMEG6002EB-QX  [NEXPERIA_PKG_SOD523]
D17  PMEG6002EB-QX  [NEXPERIA_PKG_SOD523]
R125  330R,1%,0.063W,0402  [RESC1005X04N]
R126  3k6,1%,0.063W,0402  [RESC1005X04N]
R127  330R,1%,0.063W,0402  [RESC1005X04N]
R128  1k,5%,0.063W,0402  [RESC1005X04N]
R184  10k,5%,0.063W,0402  [RESC1005X04N]
T1  750317722  [WURTH_750317722]
U1  LM317EMPX/NOPB  [TEXASINSTRUMENTS_PKG_DCY]
U2  LM337IMPX/NOPB  [TEXASINSTRUMENTS_PKG_DCY]
U14  SN6505BDBVR  [TEXASINSTRUMENTS_PKG_DBV0006A]

### Ports
EN (bidir)

### Nets
+5V0: C72.2 T1.2(PCT) U14.2(VCC)
+15VA: C71.2 D1.2(A) R125.2 U1.2(VOUT) U1.4(PAD)
+19V: C61.2 C73.2 D1.1(K) D15.2(A) D17.2(A) U1.3(VIN)
-5V0A: C76.2 D2.1(K) R127.2 U2.3(VOUT)
-19V: C62.2 C74.2 D2.2(A) D14.1(K) D16.1(K) U2.2(VIN) U2.4(PAD)
COM: C61.1 C62.1 C71.1 C72.1 C73.1 C74.1 C76.1 R126.1 R128.1 R184.2 T1.5(SCT) U14.4(GND) U14.6(CLK)
GPWR_EN: R184.1 U14.5(EN) ; port EN
NetD14_2: D14.2(A) D15.1(K) T1.4(S-)
NetD16_2: D16.2(A) D17.1(K) T1.6(S+)
NetR125_1: R125.1 R126.2 U1.1(ADJ)
NetR127_1: R127.1 R128.2 U2.1(ADJ)
NetT1_1: T1.1(P+) U14.3(D2)
NetT1_3: T1.3(P-) U14.1(D1)

### Notes on the sheet
- (near D1) +15 V @ 200 mA
- +/-19 V @ 200 mA
- (near D2) -5 V @ 200 mA
- Rev
- Sheet Name:
- Date:
- Sheet
- Designer:
- of
- (in symbol XFR,1-3.91,Lp=320uH,750317722) 1:3.91

### Library data of the parts
C61 C62 C71 C76 = CAP,Cer,1uF,35VDC,X5R,0402: 1 ï¿½F ï¿½10% 35V Ceramic Capacitor X5R 0402 (1005 Metric); Manufacturer 1: TDK Corporation; Manufacturer 1 Part Number: C1005X5R1V105K050BC; Vendor 1 Part Number: 445-9073-1-ND; Vendor 1: Digikey; Value: 1u; Part Name: CAP,Cer,1uF,35VDC,X5R,0402; CreatedBy: Judd Foster; HelpURL: https://product.tdk.com/info/en/catalog/datasheets/mlcc_commercial_general_en.pdf?ref_disty=digikey
C72-C74 = CAP,Cer,10uF,50VDC,X5R,1206: as C2 on sheet User Interface; Part Name: CAP,Cer,10uF,50VDC,X5R,1206; CreatedBy: Judd Foster; HelpURL: https://www.samsungsem.com/resources/file/global/support/product_catalog/MLCC.pdf
D1 D2 D14-D17 = DIODE,Schottky,60V,200mA,SOD523: Diode 60 V 200mA Surface Mount SOD-523; Manufacturer 1: Nexperia USA Inc.; Vendor 1: DigiKey; Part Name: DIODE,Schottky,60V,200mA,SOD523; CreatedBy: Judd Foster; HelpURL: https://assets.nexperia.com/documents/data-sheet/PMEG6002EB-Q.pdf; Manufacturer 1 Part Number: PMEG6002EB-QX; Vendor 1 Part Number: PMEG6002EB-QX
R125 R127 = RES,330R,1%,0.063W,0402: 330 Ohms Â±1% 0.063W, 1/16W Chip Resistor 0402 (1005 Metric) Moisture Resistant Thick Film; Manufacturer 1: YAGEO; Manufacturer 1 Part Number: RC0402FR-07330RL; Vendor 1 Part Number: 311-330LRCT-ND; Vendor 1: DigiKey; Value: 330; Part Name: RES,330R,1%,0.063W,0402; CreatedBy: Judd Foster; HelpURL: https://www.yageo.com/upload/media/product/products/datasheet/rchip/PYu-RC_Group_51_RoHS_L_12.pdf
R126 = RES,3k6,1%,0.063W,0402: 62.5mW 3.6kÎ© 50V Â±100ppm/â„ƒ Thick Film Resistor Â±1% 0402 Chip Resistor - Surface Mount ROHS; Manufacturer 1: FOJAN; Manufacturer 1 Part Number: FRC0402F3601TS; Vendor 1 Part Number: C2998073; Vendor 1: LCSC; Part Name: RES,3k6,1%,0.063W,0402; CreatedBy: Judd Foster; HelpURL: https://www.lcsc.com/datasheet/C2998073.pdf
R128 = RES,1k,5%,0.063W,0402: 1 kOhms ï¿½5% 0.063W, 1/16W Chip Resistor 0402 (1005 Metric) Automotive AEC-Q200 Thick Film; Manufacturer 1: Stackpole Electronics Inc; Manufacturer 1 Part Number: RMCF0402JT1K00; Vendor 1 Part Number: RMCF0402JT1K00CT-ND; Vendor 1: DIgikey; Part Name: RES,1k,5%,0.063W,0402; CreatedBy: Judd Foster; HelpURL: https://www.seielect.com/catalog/sei-rmcf_rmcp.pdf; Value: 1k
R184 = RES,10k,5%,0.063W,0402: as R153-R161 on sheet User Interface; Part Name: RES,10k,5%,0.063W,0402; CreatedBy: Judd Foster; HelpURL: https://www.seielect.com/catalog/sei-rmcf_rmcp.pdf; Value: 10k
T1 = XFR,1-3.91,Lp=320uH,750317722: Push-Pull Converters For For DC/DC Converters SMPS Transformer 2500V Isolation 350 ~ 550kHz Surface Mount; Manufacturer 1: Wurth Elektronik; Vendor 1 Part Number: 732-750317722CT-ND; Vendor 1: DigiKey; Part Name: XFR,1-3.91,Lp=320uH,750317722; CreatedBy: Judd Foster; HelpURL: https://www.we-online.com/components/products/datasheet/750317722_valid_from_2025-12-17.pdf; Manufacturer 1 Part Number: 750317722
U1 = LM317EMPX_NOPB: 80dB@(120Hz) Positive Adjustable 1.25V~37V SOT-223-4 Voltage Regulators - Linear, Low Drop Out (LDO) Regulators RoHS; Manufacturer 1: Texas Instruments; Vendor 1 Part Number: C352843; Vendor 1: LCSC; Part Name: LM317EMPX_NOPB; CreatedBy: Judd Foster; HelpURL: https://www.lcsc.com/datasheet/C352843.pdf; Manufacturer 1 Part Number: LM317EMPX/NOPB
U2 = LM337IMPX_NOPB: Linear Voltage Regulator IC Negative Adjustable 1 Output 1.5A SOT-223-4; Manufacturer 1: Texas Instruments; Vendor 1 Part Number: LM337IMPX/NOPBCT-ND; Vendor 1: DigiKey; Part Name: LM337IMPX_NOPB; CreatedBy: Judd Foster; HelpURL: https://www.ti.com/lit/ds/symlink/lm137.pdf?HQS=dis-dk-null-digikeymode-dsf-pf-null-wwe&ts=1743290709590&ref_url=https%253A%252F%252Fwww.ti.com%252Fgeneral%252Fdocs%252Fsuppproductinfo.tsp%253FdistId%253D10%2526gotoUrl%253Dhttps%253A%252F%252Fwww.ti.com%2; Manufacturer 1 Part Number: LM337IMPX/NOPB
U14 = SN6505BDBVR: Transformer Driver PMIC SOT-23-6; Manufacturer 1: Texas Instruments; Vendor 1 Part Number: 296-47311-1-ND; Vendor 1: DigiKey; Part Name: SN6505BDBVR; CreatedBy: Judd Foster; HelpURL: https://www.ti.com/general/docs/suppproductinfo.tsp?distId=10&gotoUrl=https%3A%2F%2Fwww.ti.com%2Flit%2Fgpn%2Fsn6505a; Manufacturer 1 Part Number: SN6505BDBVR